# EAGLE design thermometer_main (EAGLE 7.3.0)
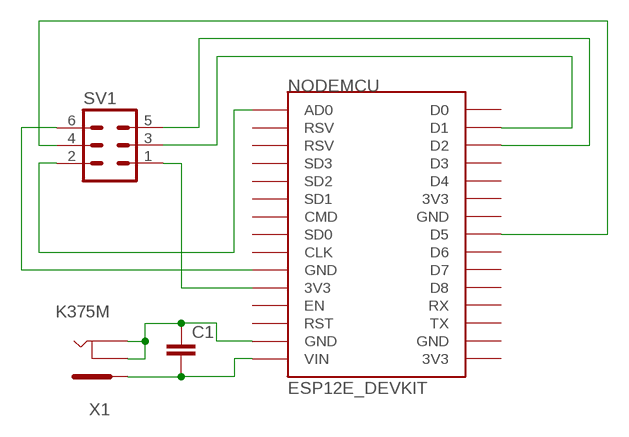
[diagram p0: schematic, sheet 1]

## Parts
C1  C-EU025-025X050  [C025-025X050]
NODEMCU  ESP12E_DEVKIT  [ESP12E_DEVKIT]
SV1  ML6L  [ML6L]
X1  K375M  [K375M]

## Nets
N$1: C1.2 NODEMCU.VIN X1.1
N$2: NODEMCU.D2 SV1.5
N$3: C1.1 NODEMCU.GND@1(GND) X1.2 X1.3
N$4: NODEMCU.AD0 SV1.2
N$5: NODEMCU.3V3@0(3V3) SV1.1
N$6: NODEMCU.GND@0(GND) SV1.6
N$7: NODEMCU.D1 SV1.3
N$8: NODEMCU.D5 SV1.4
Unconnected: NODEMCU.3V3@1(3V3) NODEMCU.3V3@2(3V3) NODEMCU.CLK NODEMCU.CMD NODEMCU.D0 NODEMCU.D3 NODEMCU.D4 NODEMCU.D6 NODEMCU.D7 NODEMCU.D8 NODEMCU.EN NODEMCU.GND@2(GND) NODEMCU.GND@3(GND) NODEMCU.RST NODEMCU.RSV@0(RSV) NODEMCU.RSV@1(RSV) NODEMCU.RX NODEMCU.SD0 NODEMCU.SD1 NODEMCU.SD2 NODEMCU.SD3 NODEMCU.TX

## Library data of the parts
C1 = rcl:C-EU: CAPACITOR, European symbol
NODEMCU = ESP12E_DEVKIT:ESP12E_DEVKIT: ESP12E DEVKIT BOARD
SV1 = con-harting-ml:ML6: HARTING; OC_FARNELL: unknown; OC_NEWARK: unknown
X1 = con-shallin:K375M: K375M - DC POWER JACK 2.5mm/CENTRAL PIN Source: Data sheet <http://www.shallin.com/productview.aspx?itemnumber=K375M>

## Board
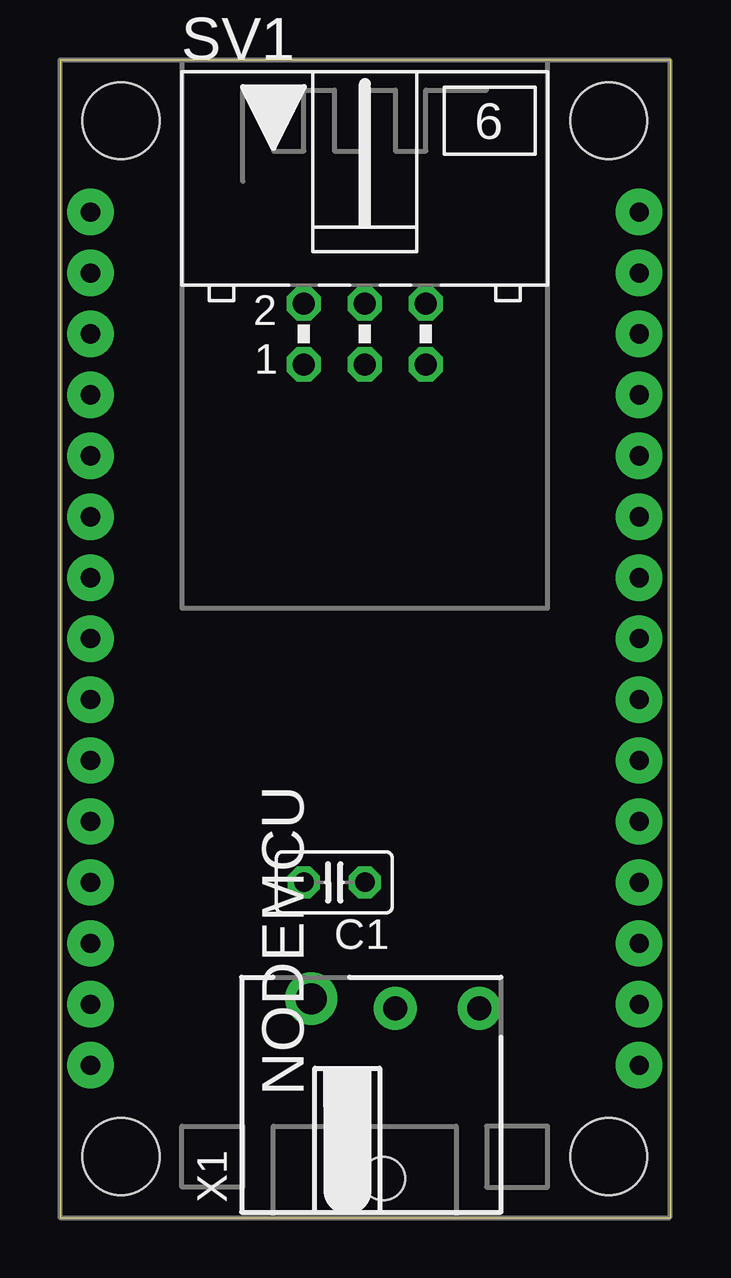
[diagram p1: board, top side]
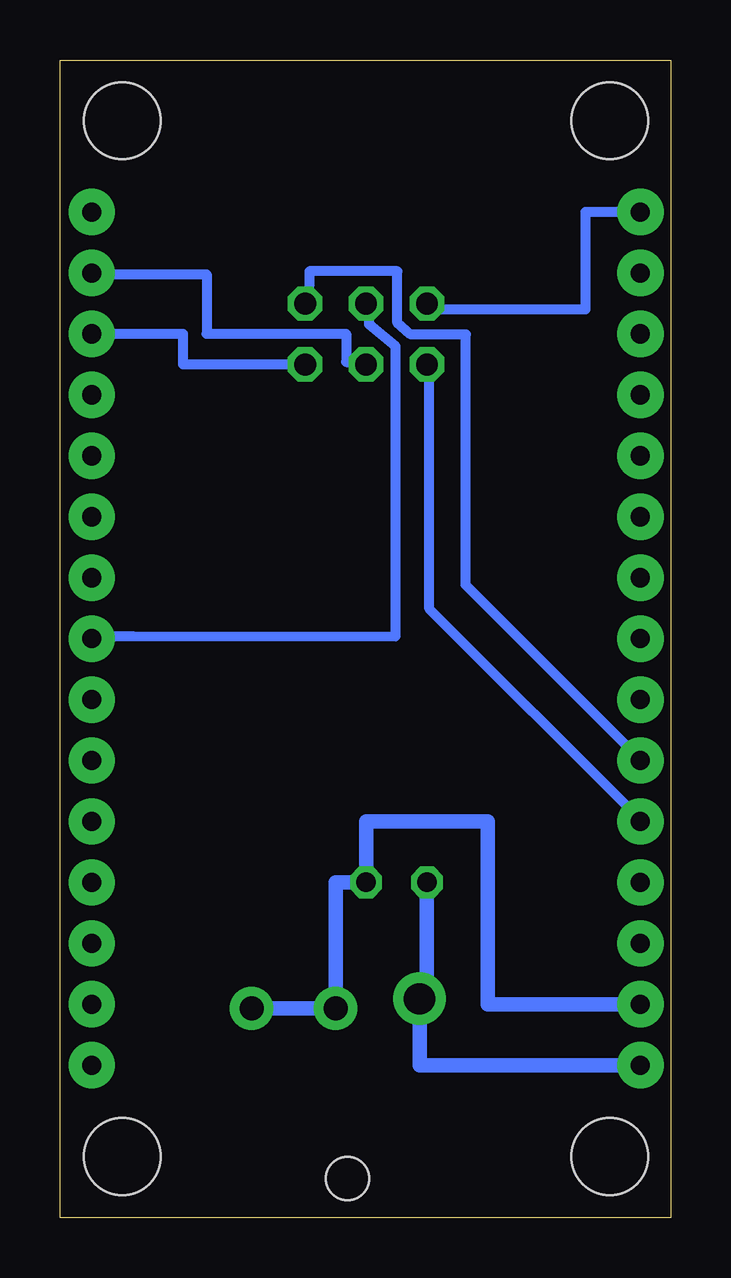
[diagram p2: board, bottom side, seen from below]

Size 25.45 x 48.25 mm. Coordinates in mm from the lower left corner, seen from the top.
Outline: 0,0 25.45,0 25.45,48.25 0,48.25 0,0
Copper layers (1*16): Top 0.035mm / dielectric 1.5mm / Bottom 0.035mm
Design rules "default": minimum track width 10mil, minimum drill 24mil, track to track 8mil, track to pad 8mil, pad to pad 8mil, via to via 8mil, smd to smd 8mil, copper to edge 40mil, drill to drill 8mil, minimum pad ring 10mil, minimum via ring 8mil, stop-mask expansion 4mil, vias tented up to drill 0mil, thermal gap 10mil
Holes 3.2 mm at 2.54,45.72 22.86,45.72 2.54,2.54 22.86,2.54

### Footprints (pad centres in the part's own frame; a part is rotated, then mirrored left to right if it is on the bottom)
C025-025X050 = drill 0.813 octagon: 1 -1.27,0; 2 1.27,0
ESP12E_DEVKIT = drill 0.8 pad 1.93: 3V3@0 -11.43,-7.62; 3V3@1 11.43,5.08; 3V3@2 11.43,-17.78; AD0 -11.43,17.78; CLK -11.43,-2.54; CMD -11.43,2.54; D0 11.43,17.78; D1 11.43,15.24; D2 11.43,12.7; D3 11.43,10.16; D4 11.43,7.62; D5 11.43,0; D6 11.43,-2.54; D7 11.43,-5.08; D8 11.43,-7.62; EN -11.43,-10.16; GND@0 -11.43,-5.08; GND@1 -11.43,-15.24; GND@2 11.43,2.54; GND@3 11.43,-15.24; RST -11.43,-12.7; RSV@0 -11.43,15.24; RSV@1 -11.43,12.7; RX 11.43,-10.16; SD0 -11.43,0; SD1 -11.43,5.08; SD2 -11.43,7.62; SD3 -11.43,10.16; TX 11.43,-12.7; VIN -11.43,-17.78 | hole 3.2: -10.16,21.59; 10.16,21.59; 10.16,-21.59; -10.16,-21.59
ML6L = drill 0.914 octagon: 1 -2.54,-1.27; 2 -2.54,1.27; 3 0,-1.27; 4 0,1.27; 5 2.54,-1.27; 6 2.54,1.27
K375M = drill 1.3 pad 2.184: 1 -3.5,1.5 | drill 1 pad 1.8: 2 3.5,1.1; 3 0,1.1 | hole 1.8: -0.5,-6

### Placement (x,y rotation side)
C1  11.43,13.97 180 top
NODEMCU  12.7,24.13 0 top
SV1  12.7,36.83 0 top
X1  13.97,7.62 0 top

### Tracks (layer width: path | path; a pad name or v marks a point on that pad's centre or on a via)
N$1
  Bottom 0.406: X1.1 10.16,9.12
  Bottom 0.61: 10.16,9.12 C1.2 | NODEMCU.VIN 10.47,6.35 X1.1
N$2
  Bottom 0.406: SV1.5 20.32,35.56 20.32,36.83 NODEMCU.D2
N$3
  Bottom 0.61: X1.2 X1.3 13.97,13.97 C1.1 12.7,16.51 7.62,16.51 7.62,8.89 NODEMCU.GND@1
N$4
  Bottom 0.406: NODEMCU.AD0 3.56,41.91 3.56,37.85 10.16,37.85 SV1.2
N$5
  Bottom 0.254: 10.06,35.43 SV1.1 | 1.37,16.69 NODEMCU.3V3@0
  Bottom 0.406: 10.06,35.43 10.06,25.38 1.37,16.69
N$6
  Bottom 0.254: 15.09,38.18 SV1.6 | 1.37,19.2 NODEMCU.GND@0
  Bottom 0.406: 15.09,38.18 15.06,39.45 11.39,39.45 11.39,37.3 10.83,36.8 8.54,36.8 8.55,26.36 1.37,19.2
N$7
  Bottom 0.254: 24,39.32 NODEMCU.D1
  Bottom 0.406: 24,39.32 19.34,39.32 19.34,36.84 13.53,36.84 13.53,35.66 12.8,35.66 SV1.3
N$8
  Bottom 0.254: 12.57,37.95 SV1.4 | 24,24.23 NODEMCU.D5
  Bottom 0.406: 12.57,37.95 12.57,37.22 11.47,36.31 11.47,24.22 22.4,24.23 24,24.23